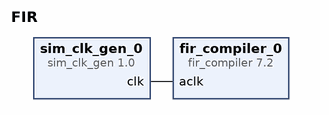
[diagram p0: block diagram of the top level]
# Vivado block design FIR, xc7vx485tffg1157-1, Vivado 2017.4
create_bd_design FIR

create_bd_cell -type ip -vlnv xilinx.com:ip:fir_compiler:7.2 fir_compiler_0
set_property -dict [list \
  CONFIG.CoefficientSource Vector \
  CONFIG.CoefficientVector -4.0625,0,-2.0625,5.3125,0,6.5 \
  CONFIG.Coefficient_Sets 1 \
  CONFIG.Coefficient_Sign Signed \
  CONFIG.Quantization Maximize_Dynamic_Range \
  CONFIG.Coefficient_Width 8 \
  CONFIG.Coefficient_Fractional_Bits 4 \
  CONFIG.Coefficient_Structure Inferred \
  CONFIG.Output_Rounding_Mode Full_Precision \
  CONFIG.Output_Width 25 \
  CONFIG.Filter_Architecture Systolic_Multiply_Accumulate \
  CONFIG.Data_Buffer_Type Automatic \
  CONFIG.Coefficient_Buffer_Type Automatic \
] [get_bd_cells fir_compiler_0]
create_bd_cell -type ip -vlnv xilinx.com:ip:sim_clk_gen:1.0 sim_clk_gen_0

# ---- connections ----

connect_bd_net [get_bd_pins sim_clk_gen_0/clk] [get_bd_pins fir_compiler_0/aclk]

validate_bd_design
save_bd_design
